# Altium schematic sheet Main.SchDoc
size A; SheetNumber: 1; SheetTotal: 7
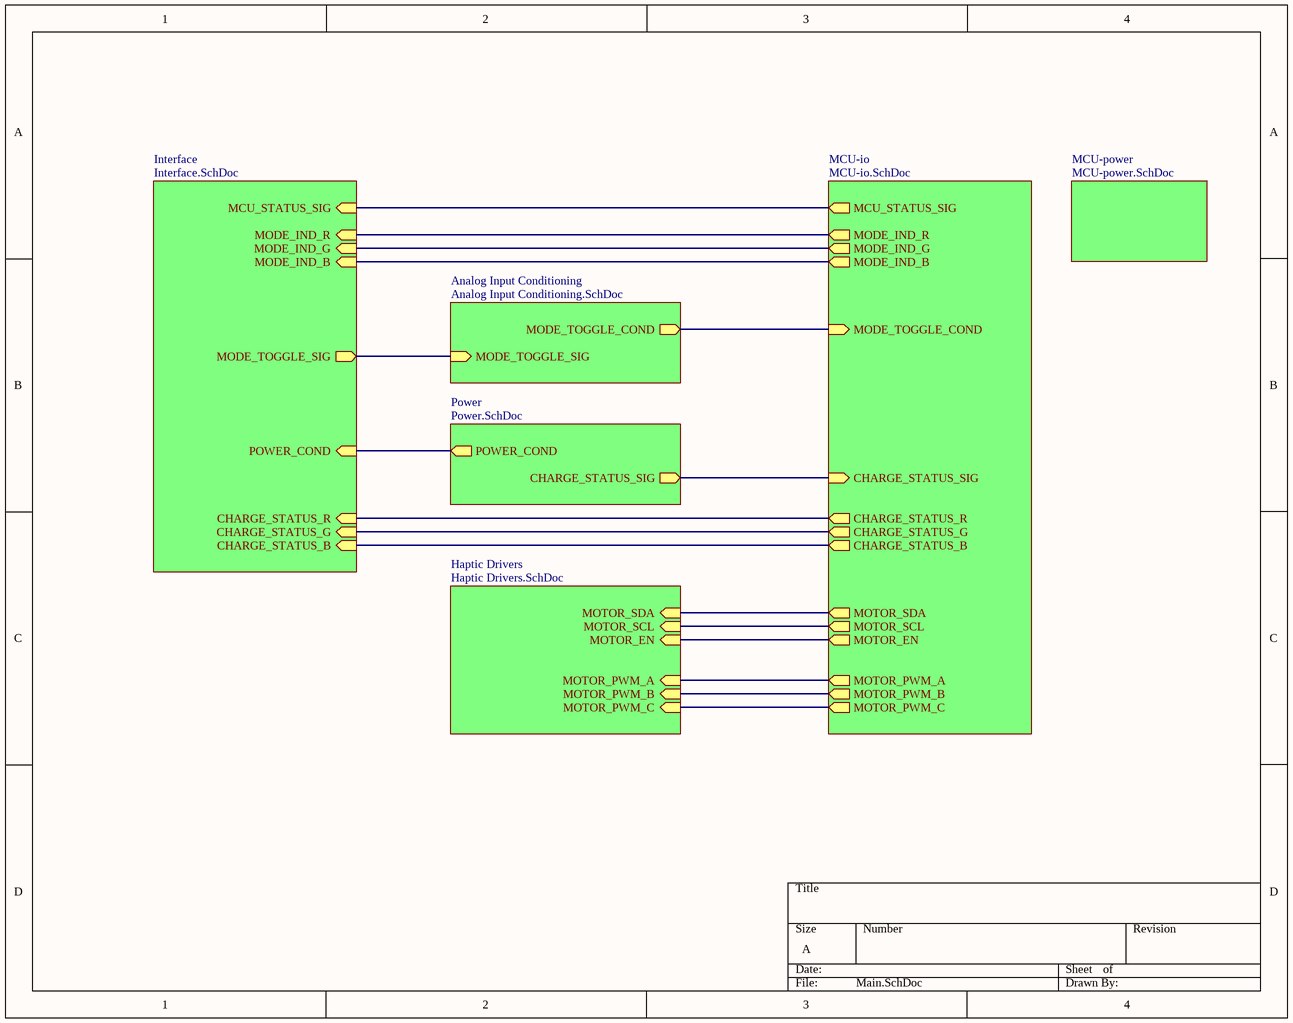
[diagram p0: Main.SchDoc]

## Sub-sheets
Analog Input Conditioning = Analog Input Conditioning.SchDoc: MODE_TOGGLE_SIG (in), MODE_TOGGLE_COND (out)
Haptic Drivers = Haptic Drivers.SchDoc: MOTOR_SDA (in), MOTOR_SCL (in), MOTOR_EN (in), MOTOR_PWM_A (in), MOTOR_PWM_B (in), MOTOR_PWM_C (in)
Interface = Interface.SchDoc: MODE_TOGGLE_SIG (out), CHARGE_STATUS_B (in), MODE_IND_R (in), MCU_STATUS_SIG (in), POWER_COND (in), MODE_IND_G (in), MODE_IND_B (in), CHARGE_STATUS_G (in), CHARGE_STATUS_R (in)
MCU-io = MCU-io.SchDoc: MODE_IND_R (out), MODE_TOGGLE_COND (in), MCU_STATUS_SIG (out), CHARGE_STATUS_SIG (in), CHARGE_STATUS_R (out), MODE_IND_G (out), MODE_IND_B (out), CHARGE_STATUS_G (out), CHARGE_STATUS_B (out), MOTOR_SDA (out), MOTOR_SCL (out), MOTOR_EN (out), MOTOR_PWM_A (out), MOTOR_PWM_B (out), MOTOR_PWM_C (out)
MCU-power = MCU-power.SchDoc: no entries
Power = Power.SchDoc: CHARGE_STATUS_SIG (out), POWER_COND (out)

## Nets
(unnamed): sheet Power/CHARGE_STATUS_SIG, sheet MCU-io/CHARGE_STATUS_SIG
(unnamed): sheet Power/POWER_COND, sheet Interface/POWER_COND
(unnamed): sheet Analog Input Conditioning/MODE_TOGGLE_SIG, sheet Interface/MODE_TOGGLE_SIG
(unnamed): sheet Analog Input Conditioning/MODE_TOGGLE_COND, sheet MCU-io/MODE_TOGGLE_COND
(unnamed): sheet Interface/CHARGE_STATUS_B, sheet MCU-io/CHARGE_STATUS_B
(unnamed): sheet Interface/MODE_IND_R, sheet MCU-io/MODE_IND_R
(unnamed): sheet Interface/MCU_STATUS_SIG, sheet MCU-io/MCU_STATUS_SIG
(unnamed): sheet Interface/MODE_IND_G, sheet MCU-io/MODE_IND_G
(unnamed): sheet Interface/MODE_IND_B, sheet MCU-io/MODE_IND_B
(unnamed): sheet Interface/CHARGE_STATUS_G, sheet MCU-io/CHARGE_STATUS_G
(unnamed): sheet Interface/CHARGE_STATUS_R, sheet MCU-io/CHARGE_STATUS_R
(unnamed): sheet MCU-io/MOTOR_SDA, sheet Haptic Drivers/MOTOR_SDA
(unnamed): sheet MCU-io/MOTOR_SCL, sheet Haptic Drivers/MOTOR_SCL
(unnamed): sheet MCU-io/MOTOR_EN, sheet Haptic Drivers/MOTOR_EN
(unnamed): sheet MCU-io/MOTOR_PWM_A, sheet Haptic Drivers/MOTOR_PWM_A
(unnamed): sheet MCU-io/MOTOR_PWM_B, sheet Haptic Drivers/MOTOR_PWM_B
(unnamed): sheet MCU-io/MOTOR_PWM_C, sheet Haptic Drivers/MOTOR_PWM_C